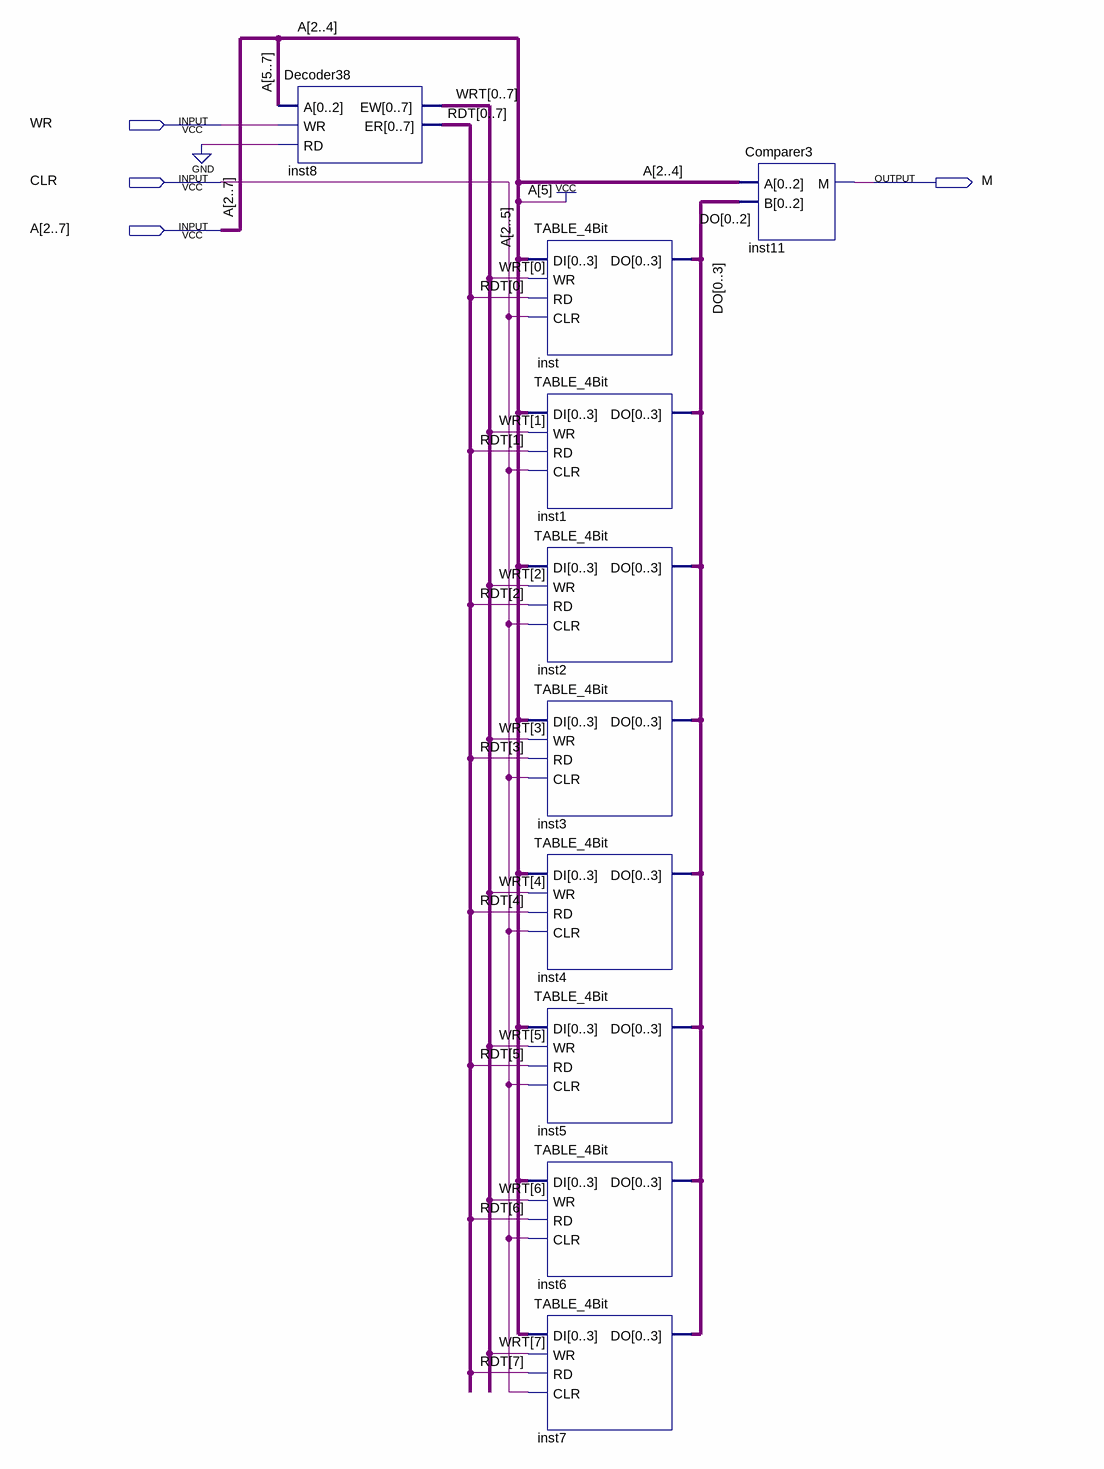
[diagram p0: schematic sheet]
// Quartus schematic TABLE_32Bit.bdf as structural Verilog: 10 symbols, 4 pins
module TABLE_32Bit (
  input  WR,
  input  CLR,
  input  [2:7] A,
  output M
);

  wire [3:0] DO;
  wire [7:0] RDT, WRT;

  Decoder38 inst8 (
    .A(A[5:7]), .WR(WR), .RD(1'b0), .EW({WRT[0], WRT[1], WRT[2], WRT[3], WRT[4], WRT[5], WRT[6], WRT[7]}),
    .ER({RDT[0], RDT[1], RDT[2], RDT[3], RDT[4], RDT[5], RDT[6], RDT[7]}));
  TABLE_4Bit inst (.DI(A[2:5]), .WR(WRT[0]), .RD(RDT[0]), .CLR(CLR), .DO({DO[0], DO[1], DO[2], DO[3]}));
  TABLE_4Bit inst1 (.DI(A[2:5]), .WR(WRT[1]), .RD(RDT[1]), .CLR(CLR), .DO({DO[0], DO[1], DO[2], DO[3]}));
  TABLE_4Bit inst2 (.DI(A[2:5]), .WR(WRT[2]), .RD(RDT[2]), .CLR(CLR), .DO({DO[0], DO[1], DO[2], DO[3]}));
  TABLE_4Bit inst3 (.DI(A[2:5]), .WR(WRT[3]), .RD(RDT[3]), .CLR(CLR), .DO({DO[0], DO[1], DO[2], DO[3]}));
  TABLE_4Bit inst4 (.DI(A[2:5]), .WR(WRT[4]), .RD(RDT[4]), .CLR(CLR), .DO({DO[0], DO[1], DO[2], DO[3]}));
  TABLE_4Bit inst5 (.DI(A[2:5]), .WR(WRT[5]), .RD(RDT[5]), .CLR(CLR), .DO({DO[0], DO[1], DO[2], DO[3]}));
  TABLE_4Bit inst6 (.DI(A[2:5]), .WR(WRT[6]), .RD(RDT[6]), .CLR(CLR), .DO({DO[0], DO[1], DO[2], DO[3]}));
  TABLE_4Bit inst7 (.DI(A[2:5]), .WR(WRT[7]), .RD(RDT[7]), .CLR(CLR), .DO({DO[0], DO[1], DO[2], DO[3]}));
  Comparer3 inst11 (.A(A[2:4]), .B({DO[0], DO[1], DO[2]}), .M(M));
  // also tied to VCC on the sheet: A[5]
endmodule
